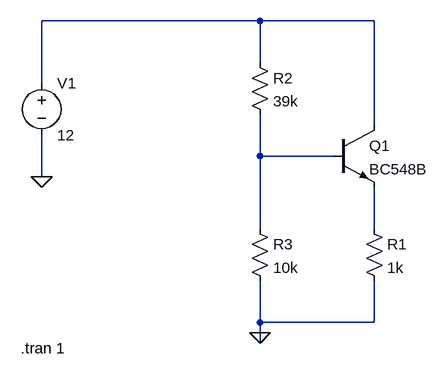
[diagram p0: schematic Ej#6.asc]
Ej#6.asc, the LTspice schematic file:
Version 4
SHEET 1 8560 1836
WIRE 64 -64 -272 -64
WIRE 240 -64 64 -64
WIRE 64 0 64 -64
WIRE -272 32 -272 -64
WIRE 240 96 240 -64
WIRE 64 144 64 80
WIRE 176 144 64 144
WIRE -272 176 -272 112
WIRE 64 256 64 144
WIRE 240 256 240 192
WIRE 64 400 64 336
WIRE 240 400 240 336
WIRE 240 400 64 400
WIRE 64 416 64 400
WIRE 64 432 64 416
FLAG 64 416 0
FLAG -272 176 0
SYMBOL npn 176 96 R0
SYMATTR InstName Q1
SYMATTR Value BC548B
SYMBOL res 224 240 R0
SYMATTR InstName R1
SYMATTR Value 1k
SYMBOL res 48 -16 R0
SYMATTR InstName R2
SYMATTR Value 39k
SYMBOL res 48 240 R0
SYMATTR InstName R3
SYMATTR Value 10k
SYMBOL voltage -272 16 R0
WINDOW 123 0 0 Left 0
WINDOW 39 0 0 Left 0
SYMATTR InstName V1
SYMATTR Value 12
TEXT 88 -256 Invisible 0 !.model BC548B NPN(Is=7.049f Xti=3 Eg=1.11 Vaf=62.79 Bf=374.6 Ise=68f Ne=1.576 Ikf=81.57m Nk=.4767 Xtb=1.5 Br=1 Isc=12.4f Nc=1.835 Ikr=3.924 Rc=.9747 Cjc=5.25p Mjc=.3147 Vjc=.5697 Fc=.5 Cje=11.5p Mje=.6715 Vje=.5 Tr=10n Tf=410.2p Itf=1.491 Xtf=40.06 Vtf=10 Vceo=30 Icrating=100m mfg=Philips)
TEXT -304 440 Left 2 !.tran 1

The netlist it stands for:
* Ej#6.asc
Q1 N001 N002 N003 0 BC548B
R1 N003 0 1k
R2 N001 N002 39k
R3 N002 0 10k
V1 N001 0 12
.model NPN NPN
.model PNP PNP
.lib standard.bjt
.model BC548B NPN(Is=7.049f Xti=3 Eg=1.11 Vaf=62.79 Bf=374.6 Ise=68f Ne=1.576 Ikf=81.57m Nk=.4767 Xtb=1.5 Br=1 Isc=12.4f Nc=1.835 Ikr=3.924 Rc=.9747 Cjc=5.25p Mjc=.3147 Vjc=.5697 Fc=.5 Cje=11.5p Mje=.6715 Vje=.5 Tr=10n Tf=410.2p Itf=1.491 Xtf=40.06 Vtf=10 Vceo=30 Icrating=100m mfg=Philips)
.tran 1
.backanno
.end